# Altium schematic sheet HDMI.SchDoc
size A2; DocumentNumber: 4; SheetNumber: 4; SheetTotal: 12
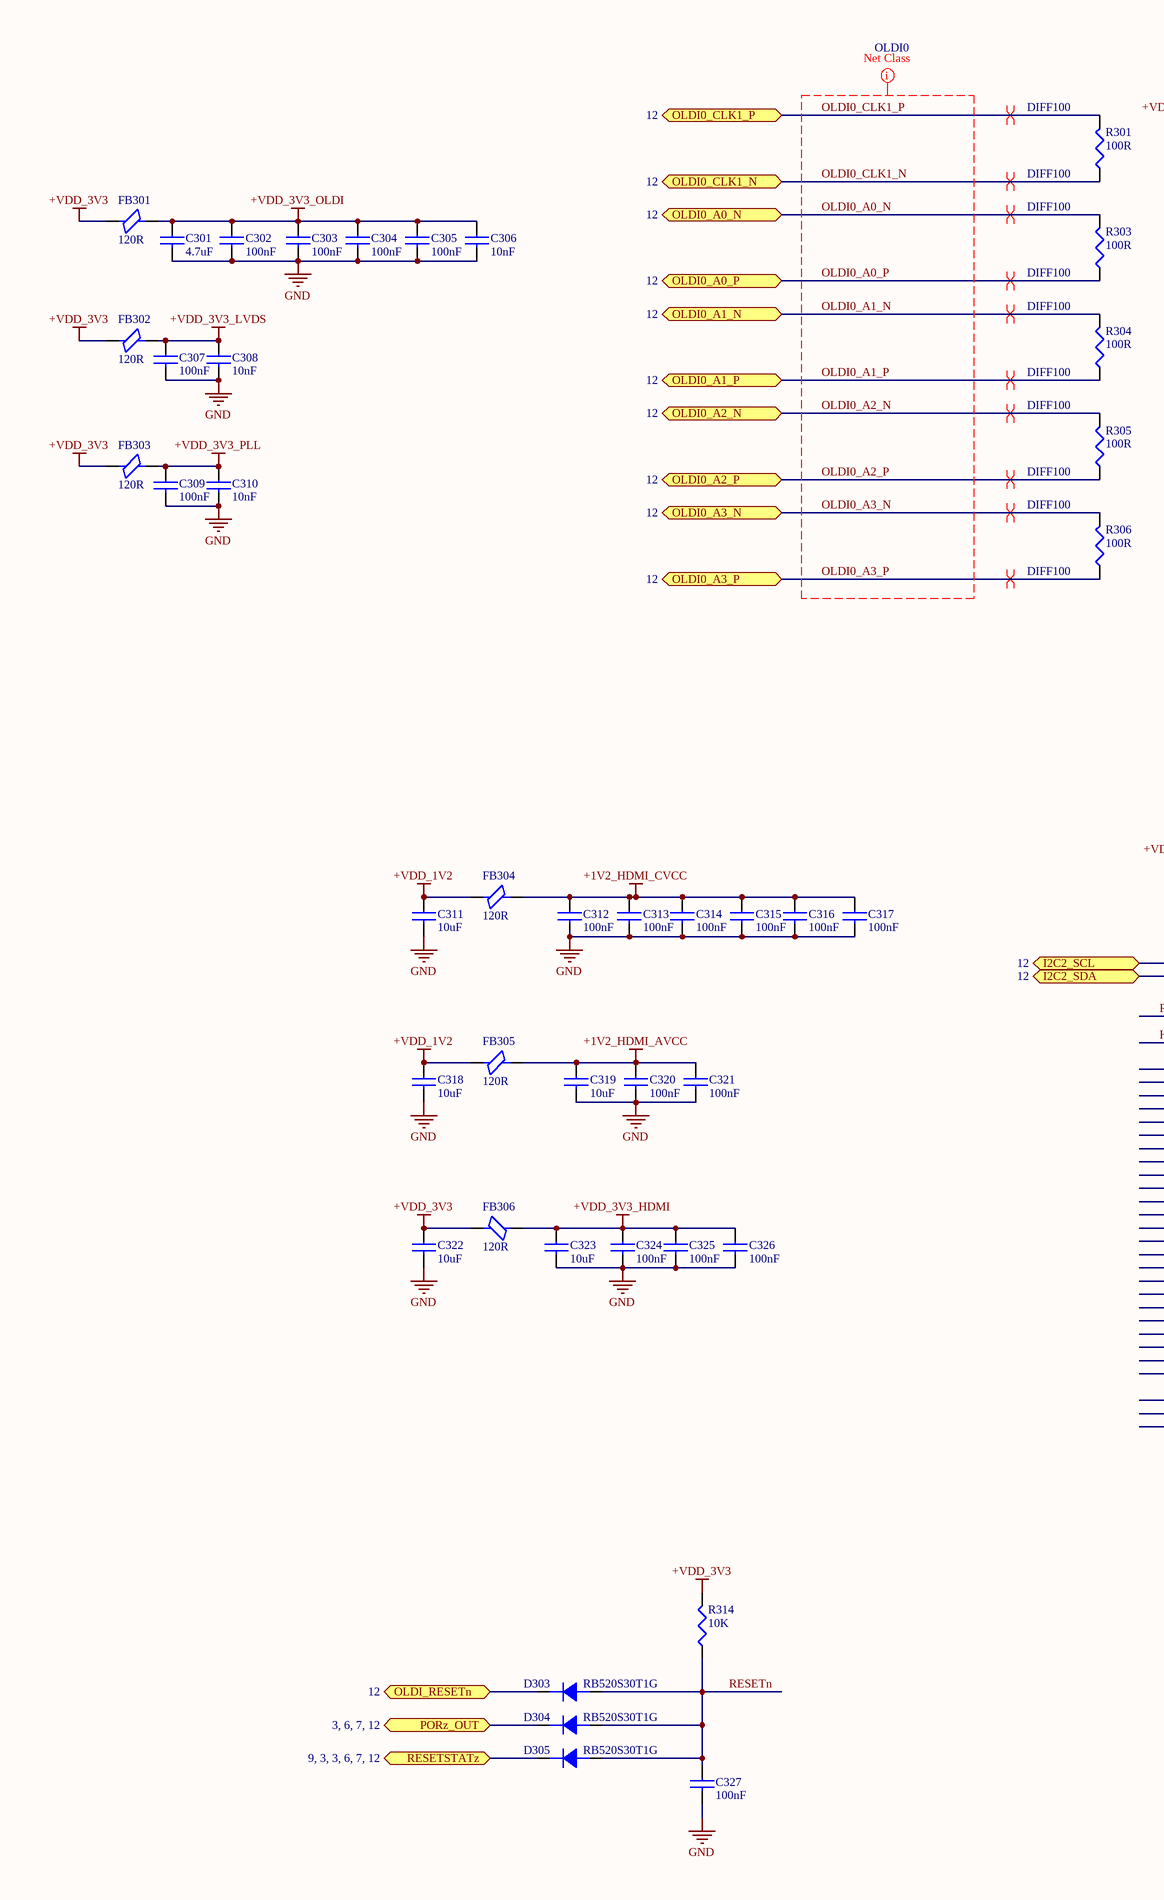
[diagram p0: HDMI.SchDoc, left]
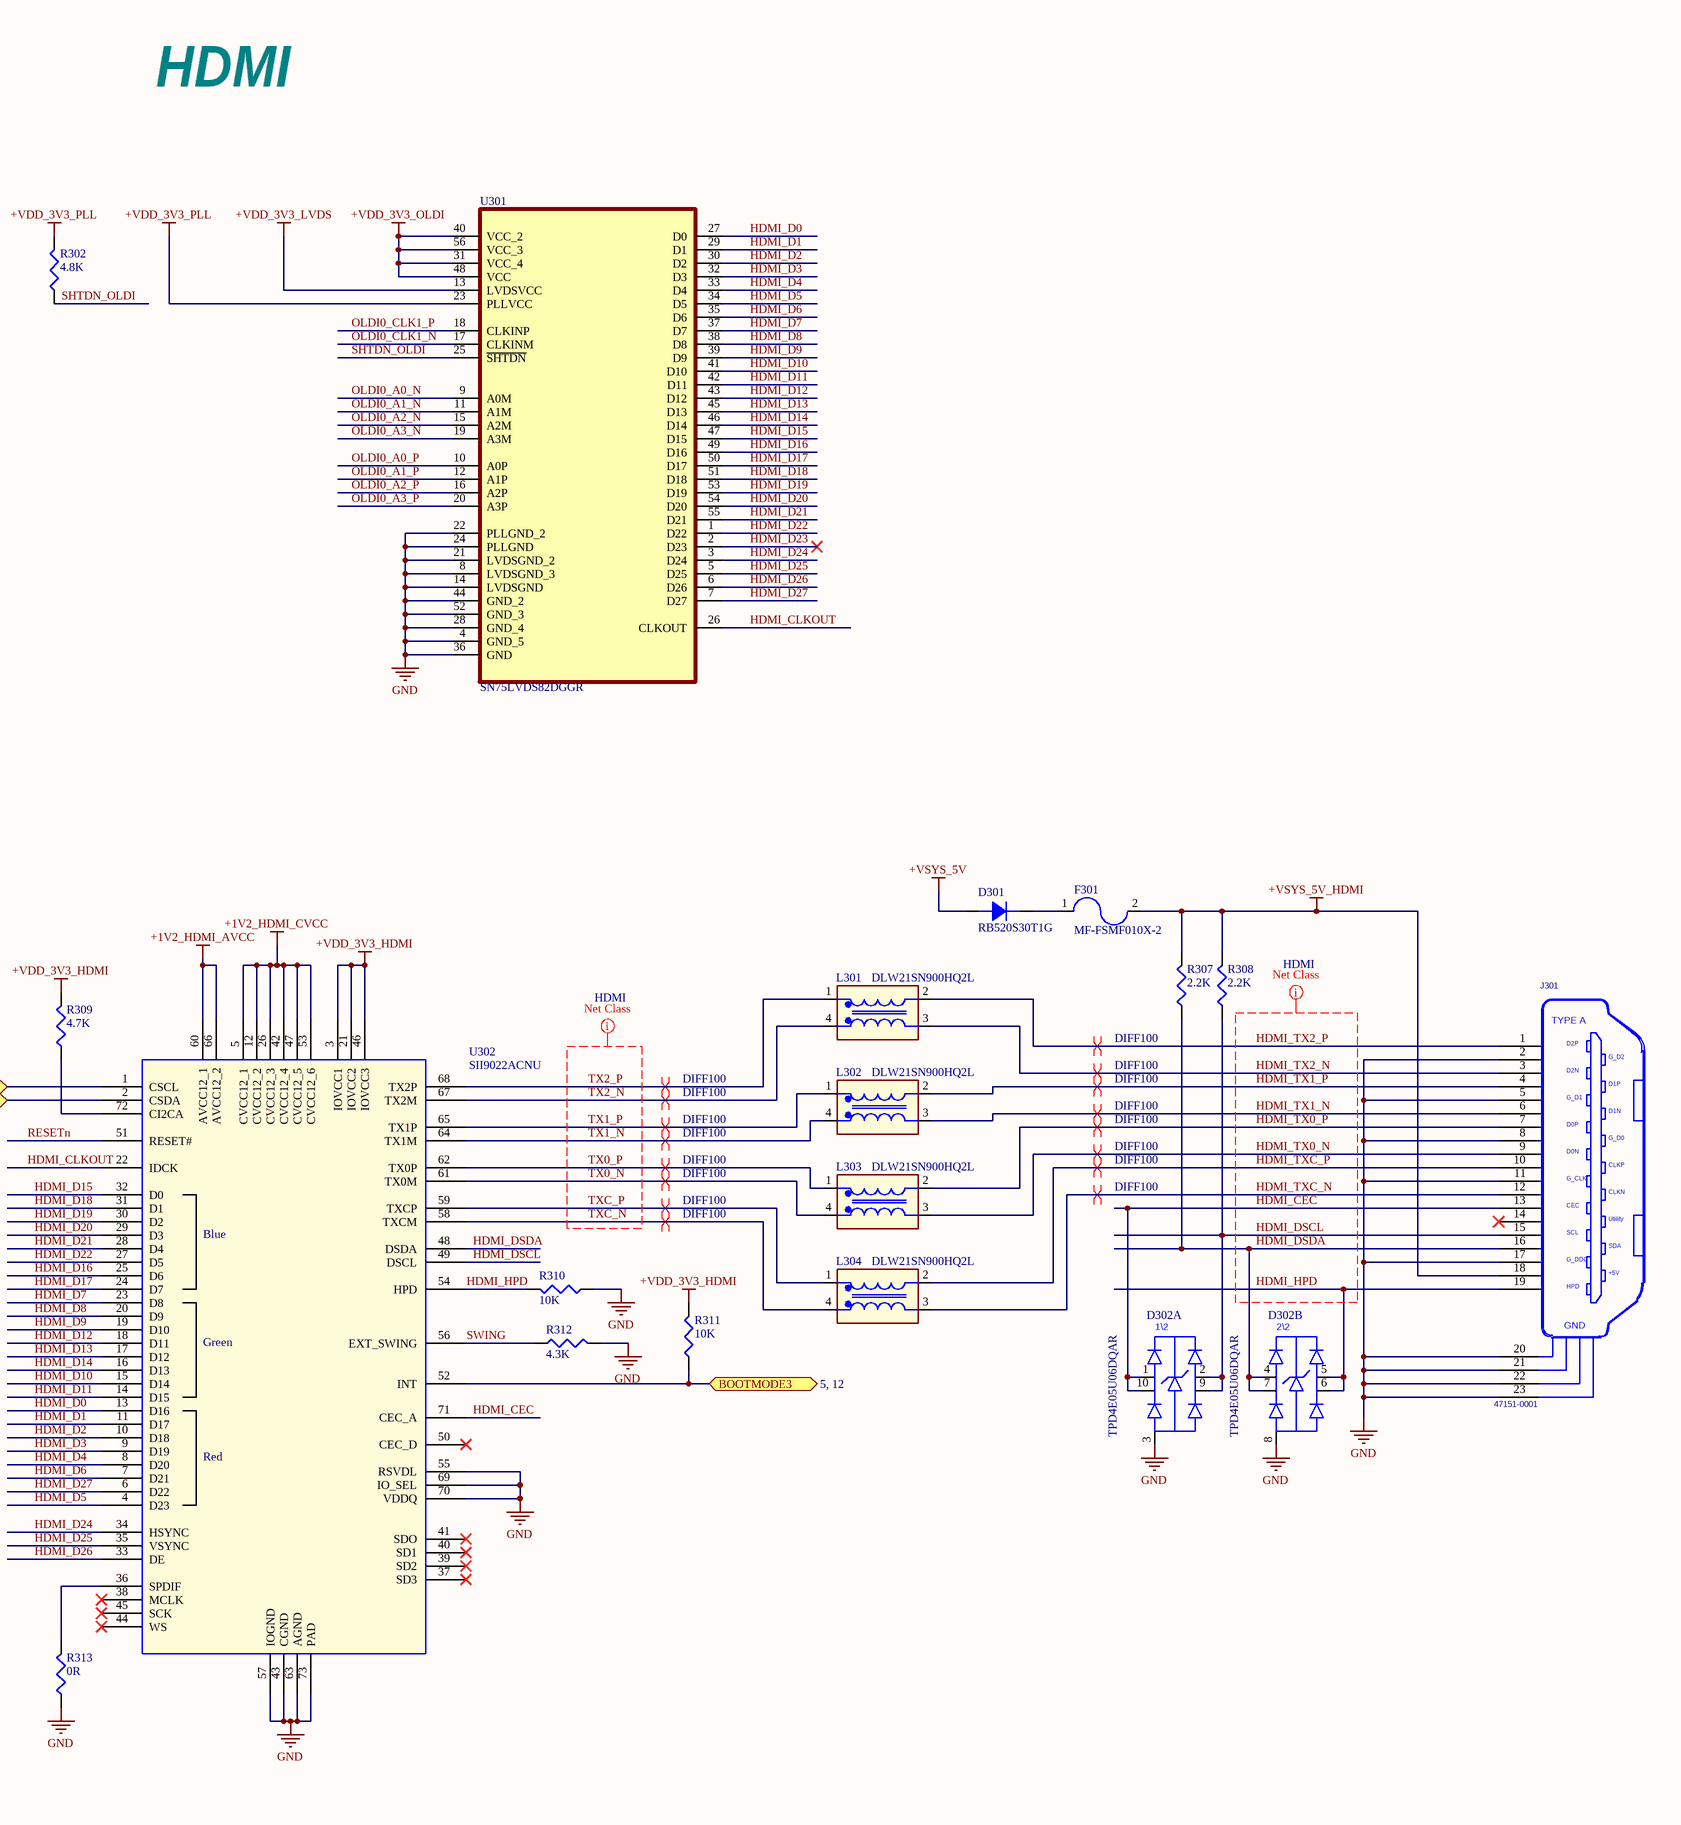
[diagram p1: HDMI.SchDoc, right]

## Parts
C301  4.7uF  [C0402]
C302  100nF  [C0603]
C303  100nF  [C0603]
C304  100nF  [C0603]
C305  100nF  [C0603]
C306  10nF  [C0402]
C307  100nF  [C0603]
C308  10nF  [C0402]
C309  100nF  [C0603]
C310  10nF  [C0402]
C311  10uF  [C0603]
C312  100nF  [C0201]
C313  100nF  [C0201]
C314  100nF  [C0201]
C315  100nF  [C0201]
C316  100nF  [C0201]
C317  100nF  [C0201]
C318  10uF  [C0603]
C319  10uF  [C0603]
C320  100nF  [C0201]
C321  100nF  [C0201]
C322  10uF  [C0603]
C323  10uF  [C0603]
C324  100nF  [C0201]
C325  100nF  [C0201]
C326  100nF  [C0201]
C327  100nF  [C0201]
D301  RB520S30T1G  [sod_523]
D302  TPD4E05U06DQAR  [10-USON]  (parts A,B of 2)
D303  RB520S30T1G  [sod_523]
D304  RB520S30T1G  [sod_523]
D305  RB520S30T1G  [sod_523]
F301  MF-FSMF010X-2  [f0603]
FB301  120R  [FB0402]
FB302  120R  [FB0402]
FB303  120R  [FB0402]
FB304  120R  [FB0402]
FB305  120R  [FB0402]
FB306  120R  [FB0402]
J301  47151-0001  [HDMI]
L301  DLW21SN900HQ2L  [IND_DLW21S_0805_MUR]
L302  DLW21SN900HQ2L  [IND_DLW21S_0805_MUR]
L303  DLW21SN900HQ2L  [IND_DLW21S_0805_MUR]
L304  DLW21SN900HQ2L  [IND_DLW21S_0805_MUR]
R301  100R  [R0402]
R302  4.8K  [R0402]
R303  100R  [R0402]
R304  100R  [R0402]
R305  100R  [R0402]
R306  100R  [R0402]
R307  2.2K  [R0201]
R308  2.2K  [R0201]
R309  4.7K  [R0402]
R310  10K  [R0201]
R311  10K  [R0201]
R312  4.3K  [R0402]
R313  0R  [R0201]
R314  10K  [R0402]
U301  SN75LVDS82DGGR  [SOP50P810X120-56N]
U302  SII9022ACNU  [QFN50P1000X1000X90-73N]

## Ports
BOOTMODE3 (bidir, see 5, 12), I2C2_SCL (bidir, see 12), I2C2_SDA (bidir, see 12), OLDI0_A0_N (bidir, see 12), OLDI0_A0_P (bidir, see 12), OLDI0_A1_N (bidir, see 12), OLDI0_A1_P (bidir, see 12), OLDI0_A2_N (bidir, see 12), OLDI0_A2_P (bidir, see 12), OLDI0_A3_N (bidir, see 12), OLDI0_A3_P (bidir, see 12), OLDI0_CLK1_N (bidir, see 12), OLDI0_CLK1_P (bidir, see 12), OLDI_RESETn (bidir, see 12), PORz_OUT (bidir, see 3, 6, 7, 12), RESETSTATz (bidir, see 9, 3, 3, 6, 7, 12)

## Nets
+1V2_HDMI_AVCC: C319.1 C320.1 C321.1 FB305.2 U302.60(AVCC12_1) U302.66(AVCC12_2)
+1V2_HDMI_CVCC: C312.1 C313.1 C314.1 C315.1 C316.1 C317.1 FB304.2 U302.5(CVCC12_1) U302.12(CVCC12_2) U302.26(CVCC12_3) U302.42(CVCC12_4) U302.47(CVCC12_5) U302.53(CVCC12_6)
+VDD_1V2: C311.1 C318.1 FB304.1 FB305.1
+VDD_3V3: C322.1 FB301.1 FB302.1 FB303.1 FB306.2 R314.2
+VDD_3V3_HDMI: C323.1 C324.1 C325.1 C326.1 FB306.1 R309.2 R311.2 U302.3(IOVCC1) U302.21(IOVCC2) U302.46(IOVCC3)
+VDD_3V3_LVDS: C307.1 C308.1 FB302.2 U301.13(LVDSVCC)
+VDD_3V3_OLDI: C301.1 C302.1 C303.1 C304.1 C305.1 C306.1 FB301.2 U301.31(VCC_4) U301.40(VCC_2) U301.48(VCC) U301.56(VCC_3)
+VDD_3V3_PLL: C309.1 C310.1 FB303.2 R302.2 U301.23(PLLVCC)
+VSYS_5V: D301.1(A)
+VSYS_5V_HDMI: F301.2 J301.18(+5V) R307.2 R308.2
GND: C301.2 C302.2 C303.2 C304.2 C305.2 C306.2 C307.2 C308.2 C309.2 C310.2 C311.2 C312.2 C313.2 C314.2 C315.2 C316.2 C317.2 C318.2 C319.2 C320.2 C321.2 C322.2 C323.2 C324.2 C325.2 C326.2 C327.2 D302.3(GND1) D302.8(GND1) J301.2(D2GND) J301.5(D1GND) J301.8(D0GND) J301.11(CKGND) J301.17(DDCGND) J301.20(GND1) J301.21(GND2) J301.22(GND3) J301.23(GND4) R310.1 R312.2 R313.1 U301.4(GND_5) U301.8(LVDSGND_3) U301.14(LVDSGND) U301.21(LVDSGND_2) U301.22(PLLGND_2) U301.24(PLLGND) U301.28(GND_4) U301.36(GND) U301.44(GND_2) U301.52(GND_3) U302.43(CGND) U302.55(RSVDL) U302.57(IOGND) U302.63(AGND) U302.69(IO_SEL) U302.70(VDDQ) U302.73(PAD)
BOOTMODE3: R311.1 U302.52(INT) ; port BOOTMODE3
HDMI_CEC: D302.1(1A) D302.10(1B) J301.13(CEC) U302.71(CEC_A)
HDMI_CLKOUT: U301.26(CLKOUT) U302.22(IDCK)
HDMI_D0: U301.27(D0) U302.13(D16)
HDMI_D1: U301.29(D1) U302.11(D17)
HDMI_D2: U301.30(D2) U302.10(D18)
HDMI_D3: U301.32(D3) U302.9(D19)
HDMI_D4: U301.33(D4) U302.8(D20)
HDMI_D5: U301.34(D5) U302.4(D23)
HDMI_D6: U301.35(D6) U302.7(D21)
HDMI_D7: U301.37(D7) U302.23(D8)
HDMI_D8: U301.38(D8) U302.20(D9)
HDMI_D9: U301.39(D9) U302.19(D10)
HDMI_D10: U301.41(D10) U302.15(D14)
HDMI_D11: U301.42(D11) U302.14(D15)
HDMI_D12: U301.43(D12) U302.18(D11)
HDMI_D13: U301.45(D13) U302.17(D12)
HDMI_D14: U301.46(D14) U302.16(D13)
HDMI_D15: U301.47(D15) U302.32(D0)
HDMI_D16: U301.49(D16) U302.25(D6)
HDMI_D17: U301.50(D17) U302.24(D7)
HDMI_D18: U301.51(D18) U302.31(D1)
HDMI_D19: U301.53(D19) U302.30(D2)
HDMI_D20: U301.54(D20) U302.29(D3)
HDMI_D21: U301.55(D21) U302.28(D4)
HDMI_D22: U301.1(D22) U302.27(D5)
HDMI_D23: U301.2(D23)
HDMI_D24: U301.3(D24) U302.34(HSYNC)
HDMI_D25: U301.5(D25) U302.35(VSYNC)
HDMI_D26: U301.6(D26) U302.33(DE)
HDMI_D27: U301.7(D27) U302.6(D22)
HDMI_DSCL: D302.2(2A) D302.9(2B) J301.15(SCL) R308.1 U302.49(DSCL)
HDMI_DSDA: D302.4(3A) D302.7(3B) J301.16(SDA) R307.1 U302.48(DSDA)
HDMI_HPD: D302.5(4A) D302.6(4B) J301.19(HPD) R310.2 U302.54(HPD)
HDMI_TX0_N: J301.9(D0-) L303.3
HDMI_TX0_P: J301.7(D0+) L303.2
HDMI_TX1_N: J301.6(D1-) L302.3
HDMI_TX1_P: J301.4(D1+) L302.2
HDMI_TX2_N: J301.3(D2-) L301.3
HDMI_TX2_P: J301.1(D2+) L301.2
HDMI_TXC_N: J301.12(CK-) L304.3
HDMI_TXC_P: J301.10(CK+) L304.2
I2C2_SCL: U302.1(CSCL) ; port I2C2_SCL
I2C2_SDA: U302.2(CSDA) ; port I2C2_SDA
OLDI0_A0_N: R303.2 U301.9(A0M) ; port OLDI0_A0_N
OLDI0_A0_P: R303.1 U301.10(A0P) ; port OLDI0_A0_P
OLDI0_A1_N: R304.2 U301.11(A1M) ; port OLDI0_A1_N
OLDI0_A1_P: R304.1 U301.12(A1P) ; port OLDI0_A1_P
OLDI0_A2_N: R305.2 U301.15(A2M) ; port OLDI0_A2_N
OLDI0_A2_P: R305.1 U301.16(A2P) ; port OLDI0_A2_P
OLDI0_A3_N: R306.2 U301.19(A3M) ; port OLDI0_A3_N
OLDI0_A3_P: R306.1 U301.20(A3P) ; port OLDI0_A3_P
OLDI0_CLK1_N: R301.1 U301.17(CLKINM) ; port OLDI0_CLK1_N
OLDI0_CLK1_P: R301.2 U301.18(CLKINP) ; port OLDI0_CLK1_P
OLDI_RESETn: D303.2(C) ; port OLDI_RESETn
PORz_OUT: D304.2(C) ; port PORz_OUT
RESETn: C327.1 D303.1(A) D304.1(A) D305.1(A) R314.1 U302.51(RESET#)
RESETSTATz: D305.2(C) ; port RESETSTATz
SHTDN_OLDI: R302.1 U301.25(~{SHTDN})
SWING: R312.1 U302.56(EXT_SWING)
TX0_N: L303.4 U302.61(TX0M)
TX0_P: L303.1 U302.62(TX0P)
TX1_N: L302.4 U302.64(TX1M)
TX1_P: L302.1 U302.65(TX1P)
TX2_N: L301.4 U302.67(TX2M)
TX2_P: L301.1 U302.68(TX2P)
TXC_N: L304.4 U302.58(TXCM)
TXC_P: L304.1 U302.59(TXCP)
NetD301_2: D301.2(C) F301.1
NetR309_1: R309.1 U302.72(CI2CA)
NetR313_2: R313.2 U302.36(SPDIF)

Not connected (* = marked no-connect by the designer): J301 14(Utility)*; U302 37(SD3)* 38(MCLK)* 39(SD2)* 40(SD1)* 41(SDO)* 44(WS)* 45(SCK)* 50(CEC_D)*

## Layout directives
net class HDMI: HDMI_CEC, HDMI_DSCL, HDMI_DSDA, HDMI_HPD, HDMI_TX0_N, HDMI_TX0_P, HDMI_TX1_N, HDMI_TX1_P, HDMI_TX2_N, HDMI_TX2_P, HDMI_TXC_N, HDMI_TXC_P, TX0_N, TX0_P, TX1_N, TX1_P, TX2_N, TX2_P, TXC_N, TXC_P
differential pair; net class DIFF100: HDMI_TX0_N, HDMI_TX0_P, HDMI_TX1_N, HDMI_TX1_P, HDMI_TX2_N, HDMI_TX2_P, HDMI_TXC_N, HDMI_TXC_P, OLDI0_A0_N, OLDI0_A0_P, OLDI0_A1_N, OLDI0_A1_P, OLDI0_A2_N, OLDI0_A2_P, OLDI0_A3_N, OLDI0_A3_P, OLDI0_CLK1_N, OLDI0_CLK1_P, TX0_N, TX0_P, TX1_N, TX1_P, TX2_N, TX2_P, TXC_N, TXC_P
net class OLDI0: OLDI0_A0_N, OLDI0_A0_P, OLDI0_A1_N, OLDI0_A1_P, OLDI0_A2_N, OLDI0_A2_P, OLDI0_A3_N, OLDI0_A3_P, OLDI0_CLK1_N, OLDI0_CLK1_P

## Notes on the sheet
- HDMI
- (in symbol 47151-0001) TYPE A; D2P; G_D2; D2N; D1P; G_D1; D1N; D0P; G_D0; D0N; CLKP; G_CLK; CLKN; G_DDC; GND
- (in symbol SII9022ACNU) Blue; Green; Red
- (in symbol TPD4E05U06DQAR, part A) 1\2
- (in symbol TPD4E05U06DQAR, part B) 2\2

## Library data of the parts
C301 = CC0402MRX5R5BB475: Multilayer Ceramic Capacitor, 4.7 uF, 6.3V, ± 10%, X5R, 0402 [1005 Metric]; Manufacturer: Yageo; Material: 4241ConductorMaterial; Temperature Coefficient: 30ppm/°C; Supplier 1: Future Electronics; Manufacturer Part Number: CC0402MRX5R5BB475; RoHS: Yes; Category: Ceramic Capacitors; Stock 1: 240000; Pricing 1: 10000=0.0195, 20000=0.019, 40000=0.0186, 50000=0.0185, 150000=0.0176 (USD); ComponentLink1URL: http://www.mouser.com/ds/2/447/UPY-GPHC_X5R_4V-to-50V_25-1131599.pdf?src-supplier=Mouser; ComponentLink1Description: http://www.mouser.com/ds/2/447/UPY-GPHC_X5R_4V-to-50V_25-1131599.pdf?src-supplier=Mouser; ComponentLink2URL: https://datasheet.octopart.com/CC0402MRX5R5BB475-Yageo-datasheet-140260304.pdf?src-supplier=Newark; ComponentLink2Description: https://datasheet.octopart.com/CC0402MRX5R5BB475-Yageo-datasheet-140260304.pdf?src-supplier=Newark; ComponentLink3URL: https://datasheet.octopart.com/CC0402MRX5R5BB475-Yageo-datasheet-137875056.pdf?src-supplier=Future+Electronics; ComponentLink3Description: https://datasheet.octopart.com/CC0402MRX5R5BB475-Yageo-datasheet-137875056.pdf?src-supplier=Future+Electronics; ComponentLink4URL: http://www.yageo.com/documents/recent/UPY-GPHC_X5R_4V-to-50V_25.pdf?src-supplier=Digi-Key; ComponentLink4Description: http://www.yageo.com/documents/recent/UPY-GPHC_X5R_4V-to-50V_25.pdf?src-supplier=Digi-Key; ComponentLink5URL: http://www.yageo.com/exep/pages/download/literatures/ProductSelectionGuide%202014_Final_2.pdf?src-supplier=Digi-Key; ComponentLink5Description: http://www.yageo.com/exep/pages/download/literatures/ProductSelectionGuide%202014_Final_2.pdf?src-supplier=Digi-Key; ComponentLink6URL: http://www.yageo.com/documents/recent/UPY-GPHC_X5R_4V-to-50V_12.pdf?src-supplier=Avnet; ComponentLink6Description: http://www.yageo.com/documents/recent/UPY-GPHC_X5R_4V-to-50V_12.pdf?src-supplier=Avnet; ComponentLink7URL: https://datasheet.octopart.com/CC0402MRX5R5BB475-Yageo-datasheet-149070021.pdf?src-supplier=TME; ComponentLink7Description: https://datasheet.octopart.com/CC0402MRX5R5BB475-Yageo-datasheet-149070021.pdf?src-supplier=TME; Supplier Part Number 1: 7044477
C302-C305 C307 C309 = C1608X7R1E104K080AA: Multilayer Ceramic Capacitor, 0.1 uF, 25 V, ± 10%, X7R, 0603 [1608 Metric]; Manufacturer: TDK; Material: 4241ConductorMaterial; Voltage Rating: 25V; Supplier 1: Arrow Electronics; Manufacturer Part Number: C1608X7R1E104K080AA; RoHS: Yes; Category: Ceramic Capacitors; Stock 1: 20; Pricing 1: 1=0.0528, 10=0.0066 (USD); Mount: Surface Mount; Case/Package: 0603; Number of Pins: 2NUMBER; Case Code (Imperial): 0603; Case Code (Metric): 1608; Dielectric Material: 4241ConductorMaterial; Min Operating Temperature: -55°C; Max Operating Temperature: 125°C; Capacitance: 100nF; Tolerance: 10%; Dielectric: X7R; Packaging: Tape and Reel; Package Quantity: 4000; Voltage: 25V; Series: C; Construction: Flat; Length: 1.6mm; Width: 0.031inch; Height: 0.8mm; Thickness: 0.037inch; Depth: 0.8mm; Reach SVHC Compliant: No; RoHS Compliant: Yes; Lead Free: 5697LeadFree; ComponentLink1URL: https://datasheet.ciiva.com/22749/1744655-22749596.pdf?src-supplier=Element14; ComponentLink1Description: https://datasheet.ciiva.com/22749/1744655-22749596.pdf?src-supplier=Element14; ComponentLink2URL: https://datasheet.ciiva.com/6250/tdkmlcccaprange-6250455.pdf?src-supplier=Digi-Key; ComponentLink2Description: https://datasheet.ciiva.com/6250/tdkmlcccaprange-6250455.pdf?src-supplier=Digi-Key; ComponentLink3URL: https://datasheet.ciiva.com/6250/tdkmlcccaprange-6250454.pdf?src-supplier=Digi-Key; ComponentLink3Description: https://datasheet.ciiva.com/6250/tdkmlcccaprange-6250454.pdf?src-supplier=Digi-Key; ComponentLink4URL: https://datasheet.ciiva.com/6250/tdkmlcccaprange-6250456.pdf?src-supplier=Digi-Key; ComponentLink4Description: https://datasheet.ciiva.com/6250/tdkmlcccaprange-6250456.pdf?src-supplier=Digi-Key; Supplier Part Number 1: C1608X7R1E104K080AA
C306 C308 C310 = C0402C103K4REC7411: ESD SMD Comm X7R 0402 (1005Metric) ceramic capacitor 0.039Lx0.020W 1.00mmx0.50mm X7R ±10% 10000pF; Manufacturer: KEMET; Supplier 1: Mouser; Manufacturer Part Number: C0402C103K4REC7411; RoHS: Yes; Category: Ceramic Capacitors; Stock 1: 20602; Pricing 1: 1=0.1, 10=0.041, 50=0.041, 100=0.024, 1000=0.02, 10000=0.015 (USD); RoHS Compliant: Yes; ComponentLink1URL: https://api.kemet.com/component-edge/download/datasheet/C0402C103K4REC7411.pdf?src-supplier=Digi-Key; ComponentLink1Description: https://api.kemet.com/component-edge/download/datasheet/C0402C103K4REC7411.pdf?src-supplier=Digi-Key; Supplier Part Number 1: 80-C0402C103K4RECLR
C311 C318 C319 C322 C323 = C1608X5R1A106K080AC: Multilayer Ceramic Capacitor, 10 uF, 10 V, ± 10%, X5R, 0603 [1608 Metric]; Manufacturer: TDK; Material: 4241ConductorMaterial; Voltage Rating (DC): 10V; Supplier 1: Arrow Electronics; Manufacturer Part Number: C1608X5R1A106K080AC; RoHS: Yes; Category: Ceramic Capacitors; Stock 1: 3399; Pricing 1: 1=0.263, 10=0.156, 25=0.1544, 50=0.1444, 100=0.1124, 250=0.1113, 500=0.1094, 1000=0.0748, 3000=0.0665 (USD); Mount: Surface Mount; Case/Package: 0603; Number of Pins: 2; Dielectric Material: Ceramic; Case Code (Imperial): 0603; Case Code (Metric): 1608; Weight: 7.1E-05oz; Min Operating Temperature: -55°C; Max Operating Temperature: 85°C; Capacitance: 10uF; Tolerance: 10%; Dielectric: X5R; Packaging: Tape and Reel; Voltage Rating: 10V; Package Quantity: 1; Termination: SMD/SMT; Voltage: 10V; Series: C; Construction: Flat; Length: 1.6mm; Width: 0.031inch; Height: 0.8mm; Depth: 0.8mm; Thickness: 0.035inch; Lead Free: Lead Free; Reach SVHC Compliant: No; RoHS Compliant: Yes; ComponentLink1URL: https://datasheet.ciiva.com/23802/1796654-23802763.pdf?src-supplier=Newark; ComponentLink1Description: https://datasheet.ciiva.com/23802/1796654-23802763.pdf?src-supplier=Newark; ComponentLink2URL: https://datasheet.ciiva.com/7975/1796654-7975065.pdf?src-supplier=Element14; ComponentLink2Description: https://datasheet.ciiva.com/7975/1796654-7975065.pdf?src-supplier=Element14; ComponentLink3URL: https://datasheet.ciiva.com/22694/1796654-22694118.pdf?src-supplier=Element14; ComponentLink3Description: https://datasheet.ciiva.com/22694/1796654-22694118.pdf?src-supplier=Element14; ComponentLink4URL: https://datasheet.ciiva.com/28577/mlcc-commercial-general-en-28577085.pdf?src-supplier=Element14; ComponentLink4Description: https://datasheet.ciiva.com/28577/mlcc-commercial-general-en-28577085.pdf?src-supplier=Element14; ComponentLink5URL: https://datasheet.ciiva.com/28577/1744655-28577071.pdf?src-supplier=Element14; ComponentLink5Description: https://datasheet.ciiva.com/28577/1744655-28577071.pdf?src-supplier=Element14; ComponentLink6URL: https://datasheet.ciiva.com/6288/tdkmlcccaprange-6288222.pdf?src-supplier=Digi-Key; ComponentLink6Description: https://datasheet.ciiva.com/6288/tdkmlcccaprange-6288222.pdf?src-supplier=Digi-Key; ComponentLink7URL: https://datasheet.ciiva.com/6288/tdkmlcccaprange-6288220.pdf?src-supplier=Digi-Key; ComponentLink7Description: https://datasheet.ciiva.com/6288/tdkmlcccaprange-6288220.pdf?src-supplier=Digi-Key; ComponentLink8URL: https://datasheet.ciiva.com/6288/tdkmlcccaprange-6288223.pdf?src-supplier=Digi-Key; ComponentLink8Description: https://datasheet.ciiva.com/6288/tdkmlcccaprange-6288223.pdf?src-supplier=Digi-Key; ComponentLink9URL: https://datasheet.ciiva.com/16449/mlcc-commercial-general-en-16449573.pdf?src-supplier=Future+Electronics; ComponentLink9Description: https://datasheet.ciiva.com/16449/mlcc-commercial-general-en-16449573.pdf?src-supplier=Future+Electronics; ComponentLink10URL: https://datasheet.ciiva.com/48671/e412-c-48671301.pdf?src-supplier=Avnet; ComponentLink10Description: https://datasheet.ciiva.com/48671/e412-c-48671301.pdf?src-supplier=Avnet; Supplier Part Number 1: C1608X5R1A106K080AC
C312-C317 C320 C321 C324-C327 = CC0201KRX5R6BB104: Multilayer Ceramic Capacitor, 0.1 uF, 16 V, ± 10%, X5R, 0201 [0603 Metric]; Manufacturer: Yageo; Material: 4241ConductorMaterial; Voltage Rating (DC): 10V; Supplier 1: Future Electronics; Manufacturer Part Number: CC0201KRX5R6BB104; RoHS: Yes; Category: Ceramic Capacitors; Stock 1: 10410000; Pricing 1: 15000=0.0027, 60000=0.0026, 150000=0.0025, 375000=0.0024, 600000=0.0023 (USD); Mount: Surface Mount; Case/Package: 0201; Case Code (Imperial): 0201; Case Code (Metric): 0603; Weight: 6E-06oz; Min Operating Temperature: -55°C; Max Operating Temperature: 85°C; Capacitance: 100nF; Tolerance: 10%; Dielectric: X5R; Packaging: Tape and Reel; Termination: SMD/SMT; Voltage Rating: 10V; Series: CC; Construction: Flat; Length: 0.6mm; Height: 0.3mm; Depth: 0.3mm; Radiation Hardening: No; RoHS Compliant: Yes; Halogen Free: 5694HalogenFree; Lead Free: 5697LeadFree; ComponentLink1URL: https://datasheet.ciiva.com/11587/upy-gphc-x5r-4v-to-50v-12-11587190.pdf?src-supplier=Avnet; ComponentLink1Description: https://datasheet.ciiva.com/11587/upy-gphc-x5r-4v-to-50v-12-11587190.pdf?src-supplier=Avnet; Supplier Part Number 1: 5050553
D301 D303-D305 = RB520S30T1G: Diode Schottky 30V 0.2A 2-Pin SOD-523 T/R - Product that comes on tape, but is not reeled; Manufacturer: ON Semiconductor; Polarity: Standard; Current Rating: 200mA; Element Configuration: Single; Forward Voltage: 600mV; Max Reverse Leakage Current: 1uA; Power Dissipation: 200mW; Supplier 1: Future Electronics; Manufacturer Part Number: RB520S30T1G; RoHS: Yes; Category: Schottky Diodes; Stock 1: 33000; Pricing 1: 3000=0.0155, 12000=0.0148, 45000=0.0143, 90000=0.0139, 225000=0.0133 (USD); Case/Package: SOD-523-2; Number of Pins: 2; Min Operating Temperature: -55°C; Max Operating Temperature: 150°C; Packaging: Tape and Reel; Voltage Rating (DC): 30V; Output Current: 200mA; Max Repetitive Reverse Voltage (Vrrm): 30V; Package Quantity: 3000; Forward Current: 200mA; Average Rectified Current: 200mA; Max Forward Surge Current (Ifsm): 200mA; Max Reverse Current: 1uA; Max Reverse Voltage (DC): 30V; Series: -; Length: 1.3mm; Width: 0.9mm; Height: 0.7mm; Radiation Hardening: No; Reach SVHC Compliant: No; Lead Free: Lead Free; RoHS Compliant: Yes; ComponentLink1URL: https://datasheet.ciiva.com/915/rb520s30t1-d-915377.pdf?src-supplier=Avnet; ComponentLink1Description: https://datasheet.ciiva.com/915/rb520s30t1-d-915377.pdf?src-supplier=Avnet; ComponentLink2URL: https://datasheet.ciiva.com/915/rb520s30t1-d-915377.pdf?src-supplier=Digi-Key; ComponentLink2Description: https://datasheet.ciiva.com/915/rb520s30t1-d-915377.pdf?src-supplier=Digi-Key; ComponentLink3URL: https://datasheet.ciiva.com/22659/1708342-22659126.pdf?src-supplier=Element14; ComponentLink3Description: https://datasheet.ciiva.com/22659/1708342-22659126.pdf?src-supplier=Element14; ComponentLink4URL: https://datasheet.ciiva.com/4715/rb520s30t1-d-101117-4715113.pdf?src-supplier=Mouser; ComponentLink4Description: https://datasheet.ciiva.com/4715/rb520s30t1-d-101117-4715113.pdf?src-supplier=Mouser; ComponentLink5URL: https://datasheet.ciiva.com/16210/rb520s30t1-d-16210917.pdf?src-supplier=Future+Electronics; ComponentLink5Description: https://datasheet.ciiva.com/16210/rb520s30t1-d-16210917.pdf?src-supplier=Future+Electronics; ComponentLink6URL: https://datasheet.ciiva.com/8292/rb520s30t1-d-8292399.pdf?src-supplier=Avnet; ComponentLink6Description: https://datasheet.ciiva.com/8292/rb520s30t1-d-8292399.pdf?src-supplier=Avnet; ComponentLink7URL: https://datasheet.ciiva.com/915/rb520s30t1-d-915378.pdf?src-supplier=Digi-Key; ComponentLink7Description: https://datasheet.ciiva.com/915/rb520s30t1-d-915378.pdf?src-supplier=Digi-Key; ComponentLink8URL: https://datasheet.ciiva.com/915/rb520s30t1-d-915379.pdf?src-supplier=Digi-Key; ComponentLink8Description: https://datasheet.ciiva.com/915/rb520s30t1-d-915379.pdf?src-supplier=Digi-Key; Supplier Part Number 1: 7657109
D302 = TPD4E05U06DQAR: Quad 0.5-pF, 5.5-V, ±12-kV ESD protection diode for USB, HDMI & High Speed Interfaces; Manufacturer: Texas Instruments; Direction: Unidirectional; Working Voltage: 5.5V; Min Breakdown Voltage: 6V; Clamping Voltage: 14V; Peak Pulse Power: 40W; Power Line Protection: Yes; Number of Channels: 4; Leakage Current: 10nA; Peak Pulse Current: 2.5A; Interface: LVDS,USB,Ethernet,HDMI,PCIe,SATA; Supplier 1: Mouser; Manufacturer Part Number: TPD4E05U06DQAR; RoHS: Yes; Category: Integrated Circuits (ICs); Stock 1: 35141; Pricing 1: 1=0.58, 10=0.487, 50=0.487, 100=0.339, 500=0.264, 1000=0.216, 3000=0.189, 9000=0.167, 10000=0.167, 24000=0.163, 45000=0.161 (USD); Mount: Surface Mount; Case/Package: SON; Number of Pins: 10; Min Operating Temperature: -40°C; Max Operating Temperature: 125°C; Packaging: Tape and Reel; Package Quantity: 3000; Polarity: Unidirectional; Reverse Standoff Voltage: 5.5V; Breakdown Voltage: 6V; Max Power Dissipation: 40W; Termination: SMD/SMT; Operating Supply Voltage: 5.5V; Series: -; Number of Unidirectional Channels: 4; Length: 2.6mm; Depth: 1.1mm; Radiation Hardening: No; Reach SVHC Compliant: No; Lead Free: Lead Free; RoHS Compliant: Yes; ComponentLink1URL: https://datasheet.ciiva.com/15063/tpd4e05u06-15063653.pdf?src-supplier=Digi-Key; ComponentLink1Description: https://datasheet.ciiva.com/15063/tpd4e05u06-15063653.pdf?src-supplier=Digi-Key; ComponentLink2URL: https://datasheet.ciiva.com/24119/slvsbo7f-316827-24119436.pdf?src-supplier=Mouser; ComponentLink2Description: https://datasheet.ciiva.com/24119/slvsbo7f-316827-24119436.pdf?src-supplier=Mouser; ComponentLink3URL: https://datasheet.ciiva.com/26918/getdatasheetpartid-716763-26918024.pdf?src-supplier=Verical; ComponentLink3Description: https://datasheet.ciiva.com/26918/getdatasheetpartid-716763-26918024.pdf?src-supplier=Verical; ComponentLink4URL: https://datasheet.ciiva.com/15063/tpd4e05u06-15063654.pdf?src-supplier=Digi-Key; ComponentLink4Description: https://datasheet.ciiva.com/15063/tpd4e05u06-15063654.pdf?src-supplier=Digi-Key; ComponentLink5URL: https://datasheet.ciiva.com/15063/tpd4e05u06-15063655.pdf?src-supplier=Digi-Key; ComponentLink5Description: https://datasheet.ciiva.com/15063/tpd4e05u06-15063655.pdf?src-supplier=Digi-Key; ComponentLink6URL: https://datasheet.ciiva.com/29883/tpd4e05u06-29883798.pdf?src-supplier=Avnet; ComponentLink6Description: https://datasheet.ciiva.com/29883/tpd4e05u06-29883798.pdf?src-supplier=Avnet; Supplier Part Number 1: 595-TPD4E05U06DQAR
F301 = MF-FSMF010X-2: PTC Resettable Fuse 0.1A(hold) 0.3A(trip) 15V 40A 0.5W 1s 0.9Ohm SMD Solder Pad 0603 T/R Automotive; Manufacturer: Bourns; Resistance: 6R; Power Dissipation: 500mW; Hold Current: 100mA; Trip Current: 300mA; Approvals: UL,TUV; Supplier 1: Digi-Key; Manufacturer Part Number: MF-FSMF010X-2; RoHS: Yes; Category: PTC Resettable Fuses; Stock 1: 14914; Pricing 1: 1=0.24, 5=0.23, 10=0.221, 50=0.1968, 100=0.1833, 250=0.16288, 500=0.13574, 1000=0.12896 (USD); Mount: Surface Mount; Case/Package: 0603; Number of Pins: 2NUMBER; Case Code (Metric): 1608; Case Code (Imperial): 0603; Terminal Material: Gold; Min Operating Temperature: -40°C; Max Operating Temperature: 85°C; Package Quantity: 5000; Max Current Rating: 40A; Packaging: Tape and Reel; Operating Supply Voltage: 15V; Voltage Rating: 15V; Termination: SMD/SMT; Voltage Rating (DC): 15V; Time to Trip: 1s; Series: MF-FSMF; Length: 1.6mm; Width: 0.8mm; Height: 0.65mm; Radiation Hardening: No; Reach SVHC Compliant: No; Lead Free: Lead Free; RoHS Compliant: Yes; ComponentLink1URL: https://datasheet.ciiva.com/22657/1482813-22657775.pdf?src-supplier=Element14; ComponentLink1Description: https://datasheet.ciiva.com/22657/1482813-22657775.pdf?src-supplier=Element14; ComponentLink2URL: https://datasheet.ciiva.com/7433/mffsmf-7433915.pdf?src-supplier=Digi-Key; ComponentLink2Description: https://datasheet.ciiva.com/7433/mffsmf-7433915.pdf?src-supplier=Digi-Key; ComponentLink3URL: https://datasheet.ciiva.com/7433/mffsmf-7433918.pdf?src-supplier=Digi-Key; ComponentLink3Description: https://datasheet.ciiva.com/7433/mffsmf-7433918.pdf?src-supplier=Digi-Key; ComponentLink4URL: https://datasheet.ciiva.com/7433/mffsmf-7433910.pdf?src-supplier=Digi-Key; ComponentLink4Description: https://datasheet.ciiva.com/7433/mffsmf-7433910.pdf?src-supplier=Digi-Key; ComponentLink5URL: https://datasheet.ciiva.com/32426/mf-fsmf-series-eng-tds-32426188.pdf?src-supplier=Distrelec; ComponentLink5Description: https://datasheet.ciiva.com/32426/mf-fsmf-series-eng-tds-32426188.pdf?src-supplier=Distrelec; ComponentLink6URL: https://datasheet.ciiva.com/28411/1482813-28411110.pdf?src-supplier=Element14; ComponentLink6Description: https://datasheet.ciiva.com/28411/1482813-28411110.pdf?src-supplier=Element14; ComponentLink7URL: https://datasheet.ciiva.com/48686/001055621-da-01-en-sich-ptc-reset-mf-fsmf010x-2-smd-0-1a-48686501.pdf?src-supplier=Conrad; ComponentLink7Description: https://datasheet.ciiva.com/48686/001055621-da-01-en-sich-ptc-reset-mf-fsmf010x-2-smd-0-1a-48686501.pdf?src-supplier=Conrad; Supplier Part Number 1: MF-FSMF010X-2CT-ND
FB301-FB306 = BLM15PD121SZ1D: Ferrite Beads Multi-Layer 120Ohm 25% 100MHz 1.3A 0.09Ohm DCR 0402 Automotive T/R; Manufacturer: Murata; Core Material: 228ConductorMaterial; Number of Lines: 1; Resistance: 90mR; Supplier 1: Arrow Electronics; Manufacturer Part Number: BLM15PD121SZ1D; RoHS: Yes; Category: Ferrite Beads and Chips; Stock 1: 10000; Pricing 1: 10000=0.0178, 20000=0.0168, 30000=0.016, 50000=0.0158 (USD); Mount: Surface Mount; Case/Package: 0402; Case Code (Imperial): 0402; Case Code (Metric): 1005; Min Operating Temperature: -55°C; Max Operating Temperature: 125°C; Packaging: Cut Tape; Max Current Rating: 1.3A; Series: EMIFIL®, BLM15; RMS Current (Irms): 1.3A; Series Resistance: 90mR; Test Frequency: 100MHz; Tolerance: 25%; Height: 550um; Ratings: AEC-Q200; RoHS Compliant: Yes; ComponentLink1URL: https://www.murata.com/en-us/products/productdata/8796748677150/QNFA9118.pdf?src-supplier=Digi-Key; ComponentLink1Description: https://www.murata.com/en-us/products/productdata/8796748677150/QNFA9118.pdf?src-supplier=Digi-Key; Supplier Part Number 1: BLM15PD121SZ1D
J301 = 47151-0001: CONN RCPT 19POS HDMI RT ANG SMD; Manufacturer: Molex Connector Corporation; .Checked PCB: used; Number of Positions: 19; Pitch: 0.50mm (.020"); Gender: Receptacle; .Checked SCH: used; Category: Connectors, Interconnects; Connector Type: HDMI; Family: USB, IEEE-1394 (Firewire), DVI, HDMI; Manufacturer Part Number: 47151-0001; Operating Temperature: -20°C to +85°C; Price 1k [$]: 1.74610; Supplier: Digikey; Supplier Part Number: WM19086CT-ND; Value: 47151-0001; Supplier 1: Digi-Key; Supplier Part Number 1: WM19086CT-ND; RoHS: RoHS Compliant; Stock 1: 2756; Pricing 1: 1=3.1, 10=2.57, 50=2.1456, 100=1.9034 (USD); Number of Contacts: 19; Specifications: -; Mounting Type: Surface Mount, Right Angle, Horizontal; Features: Detent Lock; Packaging: Cut Tape (CT); Ingress Protection: -; ComponentLink1URL: http://www.molex.com/pdm_docs/sd/471510001_sd.pdf; ComponentLink1Description: http://www.molex.com/pdm_docs/sd/471510001_sd.pdf
L301-L304 = DLW21SN900HQ2L: Ind Common Mode Choke Wirewound 90Ohm 25% 100MHz 280mA 0805 Embossed T/R; Manufacturer: Murata; Impedance: 90R; Number of Lines: 2; Shielding: Unshielded; DC Resistance (DCR): 410mR; Voltage Rating (DC): 20V; Supplier 1: Arrow Electronics; Manufacturer Part Number: DLW21SN900HQ2L; RoHS: Yes; Category: Common Mode Chokes; Stock 1: 18000; Pricing 1: 2000=0.2295, 4000=0.2273, 6000=0.225, 10000=0.2175, 24000=0.2153, 50000=0.2148 (USD); Mount: Surface Mount; Case/Package: 0805; Weight: 0.000388oz; Case Code (Imperial): 0805; Min Operating Temperature: -40°C; Max Operating Temperature: 85°C; Tolerance: 25%; Package Quantity: 1; Packaging: Tape and Reel; Current Rating: 280mA; Current: 280mA; Max DC Current: 280mA; Termination: SMD/SMT; Test Frequency: 100MHz; DC Current: 280mA; Series: EMIFIL®, DLW21S; Max Current Rating: 280mA; Length: 2mm; Width: 0.047inch; Height: 0.055inch; Depth: 1.2mm; Radiation Hardening: No; Military Standard: Not; Reach SVHC Compliant: No; Lead Free: Lead Free; RoHS Compliant: Yes; ComponentLink1URL: https://datasheet.ciiva.com/3068/l0114s0133dlw21s-3068656.pdf?src-supplier=Avnet; ComponentLink1Description: https://datasheet.ciiva.com/3068/l0114s0133dlw21s-3068656.pdf?src-supplier=Avnet; ComponentLink2URL: https://datasheet.ciiva.com/6216/l0114e-6216255.pdf?src-supplier=Digi-Key; ComponentLink2Description: https://datasheet.ciiva.com/6216/l0114e-6216255.pdf?src-supplier=Digi-Key; ComponentLink3URL: https://datasheet.ciiva.com/4952/muratadl-plseries-202927-4952310.pdf?src-supplier=Mouser; ComponentLink3Description: https://datasheet.ciiva.com/4952/muratadl-plseries-202927-4952310.pdf?src-supplier=Mouser; ComponentLink4URL: https://datasheet.ciiva.com/18183/getdatasheetpartid-228875-18183367.pdf?src-supplier=Verical; ComponentLink4Description: https://datasheet.ciiva.com/18183/getdatasheetpartid-228875-18183367.pdf?src-supplier=Verical; Supplier Part Number 1: DLW21SN900HQ2L
R301 R303-R306 = RC0402FR-07100RL: SMD Chip Resistor, 100 Ohm, ± 1%, 63 mW, 0402 [1005 Metric], Thick Film, General Purpose; Manufacturer: Yageo; Power Rating: 62.5mW; Voltage Rating: 50V; Temperature Coefficient: 100ppm/°C; Max Power Dissipation: 63mW; Supplier 1: Future Electronics; Manufacturer Part Number: RC0402FR-07100RL; RoHS: Yes; Category: Chip SMD Resistors; Stock 1: 13710000; Pricing 1: 10000=0.0008, 50000=0.0008, 250000=0.0007, 500000=0.0007, 1500000=0.0007 (USD); Case/Package: 0402; Number of Pins: 2; Case Code (Imperial): 0402; Case Code (Metric): 1005; Size Code: 0402; Min Operating Temperature: -55°C; Max Operating Temperature: 155°C; Tolerance: 1%; Voltage Rating (DC): 50V; Resistance: 100R; Packaging: Tape and Reel; Termination: SMD/SMT; Resistor Type: Thick Film; Features: Moisture Resistant; Series: RC; Number of Terminations: 2; Resistance Tolerance: 1%; Construction: Rectangular; Technology: THICK FILM; Length: 1mm; Width: 0.5mm; Height: 0.32mm; Depth: 0.5mm; RoHS Compliant: Yes; Reach SVHC Compliant: No; Military Standard: Not; Lead Free: Lead Free; ComponentLink1URL: https://datasheet.ciiva.com/7849/1784430-7849810.pdf?src-supplier=Element14; ComponentLink1Description: https://datasheet.ciiva.com/7849/1784430-7849810.pdf?src-supplier=Element14; ComponentLink2URL: https://datasheet.ciiva.com/11808/0900766b80c66297-11808765.pdf?src-supplier=Rs; ComponentLink2Description: https://datasheet.ciiva.com/11808/0900766b80c66297-11808765.pdf?src-supplier=Rs; ComponentLink3URL: https://datasheet.ciiva.com/28367/1018594-28367226.pdf?src-supplier=Element14; ComponentLink3Description: https://datasheet.ciiva.com/28367/1018594-28367226.pdf?src-supplier=Element14; ComponentLink4URL: https://datasheet.ciiva.com/22747/1018594-22747511.pdf?src-supplier=Element14; ComponentLink4Description: https://datasheet.ciiva.com/22747/1018594-22747511.pdf?src-supplier=Element14; ComponentLink5URL: https://datasheet.ciiva.com/12667/pyu-rc0402-51-rohs-l-6-r-12667957.pdf?src-supplier=Mouser; ComponentLink5Description: https://datasheet.ciiva.com/12667/pyu-rc0402-51-rohs-l-6-r-12667957.pdf?src-supplier=Mouser; ComponentLink6URL: https://datasheet.ciiva.com/16740/pyu-rc0402-51-rohs-l-6-r-16740566.pdf?src-supplier=Future+Electronics; ComponentLink6Description: https://datasheet.ciiva.com/16740/pyu-rc0402-51-rohs-l-6-r-16740566.pdf?src-supplier=Future+Electronics; ComponentLink7URL: https://datasheet.ciiva.com/15189/getdatasheetpartid-329466-15189335.pdf?src-supplier=Verical; ComponentLink7Description: https://datasheet.ciiva.com/15189/getdatasheetpartid-329466-15189335.pdf?src-supplier=Verical; Supplier Part Number 1: 2266856
R302 = Y16364K80000F9R: Res SMD 4.8K Ohm 1% 1/10W 0603; Manufacturer: VPG Foil Resistors; Resistance: 4.8kR; Max Power Dissipation: 100mW; Temperature Coefficient: 0.2ppm/°C; Supplier 1: Avnet; Manufacturer Part Number: Y16364K80000F9R; RoHS: Yes; Category: Chip SMD Resistors; Pricing 1: 100=11.9866, 110=11.9866, 210=11.9866, 500=11.9866, 1000=11.9866, 5000=11.9866, 10000=11.9866 (USD); Case/Package: 0603; Min Operating Temperature: -55°C; Max Operating Temperature: 150°C; Packaging: Tape and Reel; Number of Terminations: 2; Tolerance: 1%; Features: Moisture Resistant; Series: VSMP; Length: 0.063inch; Width: 0.032inch; Height: 0.025inch; RoHS Compliant: Yes; ComponentLink1URL: http://www.vishaypg.com/docs/63060/VSMP.pdf?src-supplier=Digi-Key; ComponentLink1Description: http://www.vishaypg.com/docs/63060/VSMP.pdf?src-supplier=Digi-Key; Supplier Part Number 1: Y16364K80000F9R
R307 R308 = RC0201FR-072K2L: SMD Chip Resistor, 2.2 kOhm, ± 1%, 50 mW, 0201 [0603 Metric], Thick Film, General Purpose; Manufacturer: Yageo; Supplier 1: Future Electronics; Manufacturer Part Number: RC0201FR-072K2L; RoHS: Yes; Category: Chip SMD Resistors; Stock 1: 2030000; Pricing 1: 10000=0.0008, 50000=0.0008, 300000=0.0007, 1000000=0.0007, 3000000=0.0006 (USD); ComponentLink1URL: https://datasheet.ciiva.com/7672/1563626-7672218.pdf?src-supplier=Element14; ComponentLink1Description: https://datasheet.ciiva.com/7672/1563626-7672218.pdf?src-supplier=Element14; Supplier Part Number 1: 3937737
R309 = RC0402FR-074K7L: SMD Chip Resistor, 4.7 kOhm, ± 1%, 63 mW, 0402 [1005 Metric], Thick Film, General Purpose; Manufacturer: Yageo; Voltage Rating (DC): 50V; Power Rating: 62.5mW; Resistance: 4.7kR; Temperature Coefficient: 100ppm/°C; Max Power Dissipation: 63mW; Supplier 1: Future Electronics; Manufacturer Part Number: RC0402FR-074K7L; RoHS: Yes; Category: Chip SMD Resistors; Stock 1: 4390000; Pricing 1: 10000=0.0008, 50000=0.0008, 250000=0.0007, 500000=0.0007, 1500000=0.0007 (USD); Case/Package: 0402; Number of Pins: 2; Case Code (Imperial): 0402; Case Code (Metric): 1005; Size Code: 0402; Min Operating Temperature: -55°C; Max Operating Temperature: 155°C; Tolerance: 1%; Voltage Rating: 50V; Packaging: Tape and Reel; Resistor Type: Thick Film; Termination: SMD/SMT; Features: Moisture Resistant; Series: RC; Number of Terminations: 2; Resistance Tolerance: 1%; Construction: Rectangular; Voltage Rating (AC): 50V; Length: 1mm; Width: 0.5mm; Depth: 0.5mm; RoHS Compliant: Yes; Reach SVHC Compliant: No; Military Standard: Not; Lead Free: Lead Free; ComponentLink1URL: https://datasheet.ciiva.com/22661/1686128-22661342.pdf?src-supplier=Element14; ComponentLink1Description: https://datasheet.ciiva.com/22661/1686128-22661342.pdf?src-supplier=Element14; ComponentLink2URL: https://datasheet.ciiva.com/7850/1018594-7850022.pdf?src-supplier=Element14; ComponentLink2Description: https://datasheet.ciiva.com/7850/1018594-7850022.pdf?src-supplier=Element14; ComponentLink3URL: https://datasheet.ciiva.com/7850/1018594-7850023.pdf?src-supplier=Element14; ComponentLink3Description: https://datasheet.ciiva.com/7850/1018594-7850023.pdf?src-supplier=Element14; ComponentLink4URL: https://datasheet.ciiva.com/15215/getdatasheetpartid-328119-15215035.pdf?src-supplier=Verical; ComponentLink4Description: https://datasheet.ciiva.com/15215/getdatasheetpartid-328119-15215035.pdf?src-supplier=Verical; Supplier Part Number 1: 3795218
R310 R311 = RC0201JR-0710KL: Res Thick Film 0201 10K Ohm 5% 1/20W ±200ppm/°C Molded SMD SMD Paper T/R; Manufacturer: Yageo; Resistance: 10kR; Power Rating: 50mW; Voltage Rating: 25V; Supplier 1: Future Electronics; Manufacturer Part Number: RC0201JR-0710KL; RoHS: Yes; Category: Chip SMD Resistors; Stock 1: 90000; Pricing 1: 10000=0.0006, 100000=0.0006, 400000=0.0005, 1250000=0.0005, 4000000=0.0005 (USD); Case/Package: 0201; Contact Plating: Tin,Matte; Case Code (Imperial): 0201; Case Code (Metric): 0603; Size Code: 0201; Min Operating Temperature: -55°C; Max Operating Temperature: 125°C; Tolerance: 5%; Resistor Type: Thick Film; Temperature Coefficient: 200ppm/°C; Packaging: Tape and Reel; Termination: SMD/SMT; Voltage Rating (DC): 25V; Features: Moisture Resistant; Series: RC; Max Power Dissipation: 50mW; Number of Terminations: 2; Resistance Tolerance: 5%; Lead Free: Lead Free; RoHS Compliant: Yes; Reach SVHC Compliant: Unknown; ComponentLink1URL: https://datasheet.ciiva.com/7660/1421516-7660810.pdf?src-supplier=Element14; ComponentLink1Description: https://datasheet.ciiva.com/7660/1421516-7660810.pdf?src-supplier=Element14; ComponentLink2URL: https://datasheet.ciiva.com/8891/pyu-rc0201-51-rohs-l-8-8891388.pdf?src-supplier=Avnet; ComponentLink2Description: https://datasheet.ciiva.com/8891/pyu-rc0201-51-rohs-l-8-8891388.pdf?src-supplier=Avnet; ComponentLink3URL: https://datasheet.ciiva.com/7672/1563626-7672254.pdf?src-supplier=Element14; ComponentLink3Description: https://datasheet.ciiva.com/7672/1563626-7672254.pdf?src-supplier=Element14; ComponentLink4URL: https://datasheet.ciiva.com/7672/1563626-7672253.pdf?src-supplier=Element14; ComponentLink4Description: https://datasheet.ciiva.com/7672/1563626-7672253.pdf?src-supplier=Element14; ComponentLink5URL: https://datasheet.ciiva.com/46391/1421516-46391291.pdf?src-supplier=Element14; ComponentLink5Description: https://datasheet.ciiva.com/46391/1421516-46391291.pdf?src-supplier=Element14; Supplier Part Number 1: 5556147
R312 = RC0402FR-074K3L: SMD Chip Resistor, 4.3 kOhm, ± 1%, 63 mW, 0402 [1005 Metric], Thick Film, General Purpose; Manufacturer: Yageo; Resistance: 4.3kR; Temperature Coefficient: 100ppm/°C; Power Rating: 63mW; Voltage Rating: 50V; Supplier 1: Future Electronics; Manufacturer Part Number: RC0402FR-074K3L; RoHS: Yes; Category: Chip SMD Resistors; Stock 1: 1910000; Pricing 1: 10000=0.0008, 50000=0.0008, 250000=0.0007, 500000=0.0007, 1500000=0.0007 (USD); Case/Package: 0402; Contact Plating: Tin,Matte; Case Code (Imperial): 0402; Case Code (Metric): 1005; Size Code: 0402; Min Operating Temperature: -55°C; Max Operating Temperature: 155°C; Tolerance: 1%; Resistor Type: Thick Film; Packaging: Tape and Reel; Termination: SMD/SMT; Voltage Rating (DC): 50V; Features: Moisture Resistant; Series: RC; Max Power Dissipation: 63mW; Number of Terminations: 2; Construction: Rectangular; Resistance Tolerance: 1%; Length: 1mm; Depth: 0.5mm; Military Standard: Not; Lead Free: Lead Free; RoHS Compliant: Yes; Reach SVHC Compliant: Unknown; ComponentLink1URL: https://datasheet.ciiva.com/7850/1018594-7850021.pdf?src-supplier=Element14; ComponentLink1Description: https://datasheet.ciiva.com/7850/1018594-7850021.pdf?src-supplier=Element14; ComponentLink2URL: https://datasheet.ciiva.com/12666/pyu-rc0402-51-rohs-l-6-r-12666953.pdf?src-supplier=Mouser; ComponentLink2Description: https://datasheet.ciiva.com/12666/pyu-rc0402-51-rohs-l-6-r-12666953.pdf?src-supplier=Mouser; ComponentLink3URL: https://datasheet.ciiva.com/8893/pyu-rc0402-51-rohs-l-6-8893173.pdf?src-supplier=Avnet; ComponentLink3Description: https://datasheet.ciiva.com/8893/pyu-rc0402-51-rohs-l-6-8893173.pdf?src-supplier=Avnet; ComponentLink4URL: https://datasheet.ciiva.com/17086/pyu-rc0402-51-rohs-l-6-r-17086539.pdf?src-supplier=Future+Electronics; ComponentLink4Description: https://datasheet.ciiva.com/17086/pyu-rc0402-51-rohs-l-6-r-17086539.pdf?src-supplier=Future+Electronics; Supplier Part Number 1: 1610732
R313 = RC0201JR-070RL: Zero Ohm Resistor, Jumper, 0201 [0603 Metric], Thick Film, 50 mW, 500 mA, Surface Mount; Manufacturer: Yageo; Power Rating: 50mW; Tolerance: 5%; Voltage Rating: 25V; Temperature Coefficient: 200ppm/°C; Supplier 1: Future Electronics; Manufacturer Part Number: RC0201JR-070RL; RoHS: Yes; Category: Chip SMD Resistors; Stock 1: 7600000; Pricing 1: 10000=0.0009, 50000=0.0009, 250000=0.0008, 500000=0.0008, 1500000=0.0007 (USD); Case/Package: 0201; Contact Plating: Tin,Matte; Case Code (Metric): 0603; Case Code (Imperial): 0201; Weight: 6E-06oz; Size Code: 0201; Min Operating Temperature: -55°C; Max Operating Temperature: 125°C; Resistor Type: Thick Film; Packaging: Tape and Reel; Resistance: 0R; Package Quantity: 1; Series: RC; Number of Terminations: 2; Termination: SMD/SMT; Max Power Dissipation: 50mW; Voltage Rating (DC): 25V; Features: Moisture Resistant; Resistance Tolerance: 5%; Length: 0.024inch; Width: 0.012inch; Height: 0.01inch; RoHS Compliant: Yes; Lead Free: Lead Free; Reach SVHC Compliant: Unknown; ComponentLink1URL: https://datasheet.ciiva.com/7672/1563626-7672248.pdf?src-supplier=Element14; ComponentLink1Description: https://datasheet.ciiva.com/7672/1563626-7672248.pdf?src-supplier=Element14; ComponentLink2URL: https://datasheet.ciiva.com/7660/1421516-7660808.pdf?src-supplier=Element14; ComponentLink2Description: https://datasheet.ciiva.com/7660/1421516-7660808.pdf?src-supplier=Element14; ComponentLink3URL: https://datasheet.ciiva.com/8896/pyu-rc0201-51-rohs-l-8-8896143.pdf?src-supplier=Avnet; ComponentLink3Description: https://datasheet.ciiva.com/8896/pyu-rc0201-51-rohs-l-8-8896143.pdf?src-supplier=Avnet; ComponentLink4URL: https://datasheet.ciiva.com/7672/1563626-7672247.pdf?src-supplier=Element14; ComponentLink4Description: https://datasheet.ciiva.com/7672/1563626-7672247.pdf?src-supplier=Element14; ComponentLink5URL: https://datasheet.ciiva.com/46391/1421516-46391340.pdf?src-supplier=Element14; ComponentLink5Description: https://datasheet.ciiva.com/46391/1421516-46391340.pdf?src-supplier=Element14; Supplier Part Number 1: 9983388
R314 = RC0402FR-0710KL: RES 10.0K OHM 1/16W 1% 0402 SMD; Manufacturer: Yageo; Power (Watts): 0.063W, 1/16W; .Checked PCB: used; Temperature Coefficient: ±100ppm/°C; Category: Resistors; Supplier Part Number: 311-10.0KLRCT-ND; Manufacturer Part Number: RC0402FR-0710KL; Package / Case: 0402 (1005 Metric); Price 1k [$]: 0.01421; Resistance (Ohms): 10K; Tolerance: ±1%; Value: 10k; .Checked SCH: used; Supplier: Digikey; Supplier 1: Digi-Key; Supplier Part Number 1: 311-10.0KLRCT-ND; RoHS: RoHS Compliant; Stock 1: 2916495; Pricing 1: 10=0.014, 50=0.0104, 100=0.0079, 250=0.00584, 500=0.00432, 1000=0.00288 (USD); Composition: Thick Film; Features: -; Size / Dimension: 0.039" L x 0.020" W (1.00mm x 0.50mm); Height: 0.016" (0.40mm); Number of Terminations: 2; Packaging: Cut Tape (CT); ComponentLink1URL: http://www.yageo.com/documents/recent/PYu-RC0402_51_RoHS_L_6.pdf; ComponentLink1Description: http://www.yageo.com/documents/recent/PYu-RC0402_51_RoHS_L_6.pdf
U301 = SN75LVDS82DGGR: 0/5 Receiver  LVDS 56-TSSOP; Manufacturer: Texas Instruments; Number of Elements: 4; Operating Supply Voltage: 3.3V; Data Rate: 238Mbps; Number of Drivers: 28; Power Dissipation: 1.377W; Supplier 1: Mouser; Manufacturer Part Number: SN75LVDS82DGGR; RoHS: Yes; Category: Interface ICs; Stock 1: 10721; Pricing 1: 1=5.58, 10=4.78, 50=4.78, 100=4.11, 1000=2.93, 10000=2.82 (USD); Case/Package: TSSOP; Number of Pins: 56; Weight: 0.008229oz; Min Operating Temperature: 0°C; Max Operating Temperature: 70°C; Packaging: Tape and Reel; Number of Receivers: 4; Package Quantity: 1; Series: FlatLink™; Radiation Hardening: No; Lead Free: Lead Free; RoHS Compliant: Yes; ComponentLink1URL: https://datasheet.ciiva.com/3153/sn75lvds82-3153173.pdf?src-supplier=Avnet; ComponentLink1Description: https://datasheet.ciiva.com/3153/sn75lvds82-3153173.pdf?src-supplier=Avnet; ComponentLink2URL: https://datasheet.ciiva.com/1706/sn75lvds82-1706762.pdf?src-supplier=Digi-Key; ComponentLink2Description: https://datasheet.ciiva.com/1706/sn75lvds82-1706762.pdf?src-supplier=Digi-Key; ComponentLink3URL: https://datasheet.ciiva.com/1706/sn75lvds82-1706763.pdf?src-supplier=Digi-Key; ComponentLink3Description: https://datasheet.ciiva.com/1706/sn75lvds82-1706763.pdf?src-supplier=Digi-Key; ComponentLink4URL: https://datasheet.ciiva.com/1706/sn75lvds82-1706764.pdf?src-supplier=Digi-Key; ComponentLink4Description: https://datasheet.ciiva.com/1706/sn75lvds82-1706764.pdf?src-supplier=Digi-Key; ComponentLink5URL: https://datasheet.ciiva.com/41461/001187617-da-01-en-ic-flatlink-sn75lvds82dggr-tssop-56-tid-41461068.pdf?src-supplier=Conrad; ComponentLink5Description: https://datasheet.ciiva.com/41461/001187617-da-01-en-ic-flatlink-sn75lvds82dggr-tssop-56-tid-41461068.pdf?src-supplier=Conrad; Supplier Part Number 1: 595-SN75LVDS82DGGR
U302 = SII9022ACNU: 24-Bit RGB Input HDMI 1.4a Transmitter, 1080p@60Hz, no HDCP, 72-pin QFN; Manufacturer: Lattice Semiconductor; Supplier 1: Arrow Electronics; Manufacturer Part Number: SII9022ACNU; RoHS: No; Stock 1: 672; Pricing 1: 168=4.497, 504=4.493, 1008=4.489, 2520=4.485, 5040=4.481, 105000=4.477 (USD); Supplier Part Number 1: SII9022ACNU